# Altium schematic sheet lcd.SchDoc
size A
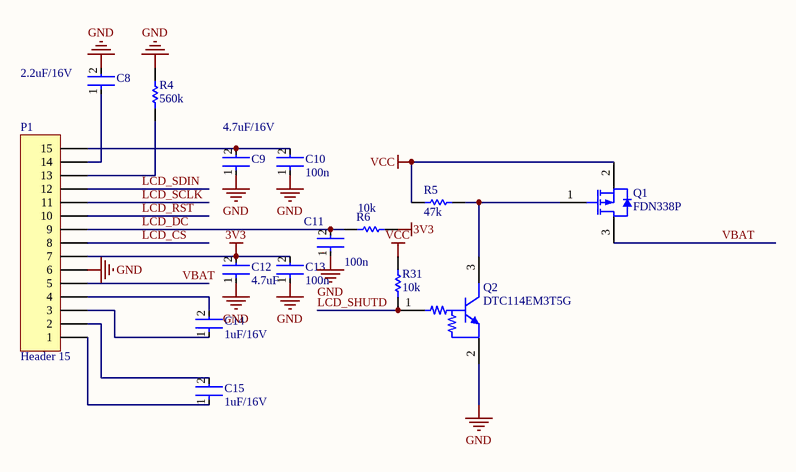
[diagram p0: lcd.SchDoc]

## Parts
C8  2.2uF/16V  [FP-GRM188-0_1-e0_2_0_55-IPC_A]
C9  4.7uF/16V  [FP-GRM188-0_1-e0_2_0_55-IPC_A]
C10  100n  [FP-GRM155-0_05-IPC_A]
C11  100n  [FP-GRM155-0_05-IPC_A]
C12  4.7uF  [FP-GRM188-0_1-e0_2_0_55-IPC_A]
C13  100n  [FP-GRM155-0_05-IPC_A]
C14  1uF/16V  [FP-GRM188-0_1-e0_2_0_55-IPC_A]
C15  1uF/16V  [FP-GRM188-0_1-e0_2_0_55-IPC_A]
P1  Header 15  [FLEX_CONN]
Q1  FDN338P  [FAIR-SSOT3L-3_V]
Q2  DTC114EM3T5G  [ONSC-SOT-723-3-631AA-01_V]
R4  560k  [RESC1005X40X25NL05T10]
R5  47k  [RESC1005X40X25NL05T10]
R6  10k  [RESC1005X40X25NL05T10]
R31  10k  [RESC1005X40X25NL05T10]

## Nets
3V3: C12.2 C13.2 P1.7 R6.1
GND: C8.2 C9.1 C10.1 C11.1 C12.1 C13.1 P1.6 Q2.2(E) R4.2
VCC: Q1.2(SOURCE) R5.1 R31.2
LCD_CS: P1.8
LCD_DC: C11.2 P1.9 R6.2
LCD_RST: P1.10
LCD_SCLK: P1.11
LCD_SDIN: P1.12
LCD_SHUTD: Q2.1(B) R31.1
VBAT: P1.5 Q1.3(DRAIN)
NetC8_1: C8.1 P1.14
NetC9_2: C9.2 C10.2 P1.15
NetC14_1: C14.1 P1.3
NetC14_2: C14.2 P1.4
NetC15_1: C15.1 P1.1
NetC15_2: C15.2 P1.2
NetP1_13: P1.13 R4.1
NetQ1_1: Q1.1(GATE) Q2.3(C) R5.2

## Library data of the parts
C8 C9 C12 C14 C15 = CMP-2006-02792-2: Chip Multilayer Ceramic Capacitors for General Purpose, 0603, 10uF, X5R, 15%, 20%, 6.3V; Packaging: Tape and Reel; Voltage Rating (DC): 6.3V; Width: 0.031inch; Termination: SMD/SMT; Dielectric: X5R; Package Quantity: 4000; Voltage Rating: 6.3V; Capacitance: 10uF; Case/Package: 0603; Min Operating Temperature: -55°C; Voltage: 6.3V; Length: 1.6mm; Thickness: 0.035inch; Lead Free: Lead Free; Depth: 0.8mm; Case Code (Imperial): 0603; Max Operating Temperature: 85°C; Material: Ceramic; Height: 0.8mm; Tolerance: 20%; Mount: Surface Mount; REACH SVHC: No SVHC; Radiation Hardening: No; Case Code (Metric): 1608
C10 C11 C13 = CMP-2008-04369-2: Chip Multilayer Ceramic Capacitors for General Purpose, 0402, 470pF, C0G, 30ppm/°C, 5%, 50V; Insulation Resistance: 10GR; Depth: 0.5mm; Voltage Rating: 50V; Packaging: Tape and Reel; Material: Ceramic; Lead Free: Lead Free; Max Operating Temperature: 125°C; Length: 1mm; Min Operating Temperature: -55°C; Height: 0.5mm; Width: 0.5mm; Thickness: 0.022inch; Voltage: 50V; Termination: SMD/SMT; Dielectric Material: Ceramic; REACH SVHC: No SVHC; Voltage Rating (DC): 50V; Package Quantity: 1; Dielectric: C0G; Radiation Hardening: No; Mount: Surface Mount; Case/Package: 0402; Number of Pins: 2; Tolerance: 5%; Temperature Coefficient: 30ppm/°C; Case Code (Metric): 1005; Capacitance: 470pF; Case Code (Imperial): 0402
P1 = Header 15: Header, 15-Pin; LatestRevisionDate: 17-Jul-2002; LatestRevisionNote: Re-released for DXP Platform.; Publisher: Altium Limited
Q1 = CMP-2000-06251-1: P-Channel Specified Power Trench(R) MOSFET, 2.5 V, -20 V, -1.6 A, -55 to 150 degC, 3-Pin SOT23, RoHS, Tape and Reel; Manufacturer: Fairchild Semiconductor; Current - Continuous Drain (Id) @ 25°C: 1.6A(Ta); Product Training Modules: HighVoltageSwitchesforPowerProcessingSMPSPowerSwitch; Gate Charge (Qg) @ Vgs: 6.2nC@4.5V; Package Version: Rev. 3, 05/2015; PCN Design/Specification: MoldCompound08/April/2008; Vgs(th) (Max) @ Id: 1.5V@250µA; FET Type: MOSFETP-Channel,MetalOxide; FET Feature: Standard; PCN Packaging: BinaryYearCodeMarking15/Jan/2014; Other Names: FDN338PTR; Online Catalog: P-ChannelLogicLevelGateFETs; Input Capacitance (Ciss) @ Vds: 451pF@10V; Rds On (Max) @ Id, Vgs: 115mOhm@1.6A,4.5V; Drain to Source Voltage (Vdss): 20V; Power - Max: 460mW; Datasheet Version: Rev. F1(W), 11/2013; Manufacturer URL: https://www.fairchildsemi.com/; Package Description: 3-Pin Small Outline Transistor, Body 2.92 x 1.4 mm, Pitch 0.95 mm; Datasheet URL: https://datasheet.ciiva.com/22655/1802191-22655335.pdf; Family: FETs-Single; Package URL: https://www.fairchildsemi.com/package-drawings/MA/MA03B.pdf; Package Reference: SSOT3L; Supplier Device Package: 3-SSOT; Standard Package: 3,000; Package / Case: TO-236-3,SC-59,SOT-23-3; Mounting Technology: SurfaceMount; Series: PowerTrench®; Mounting Type: SurfaceMount; Packaging: Tape&Reel(TR); Category: DiscreteSemiconductorProducts
Q2 = CMP-0630-00443-1: Digital Transistor (BRT), R1=10 kOhm, R2=10 kOhm, NPN Transistor, 3-Pin SOT-723, Pb-Free, Tape and Reel; Manufacturer: On Semiconductor; V(BR)CEO Min (V): 50; R1/R2 Typ: 1; IC Continuous (A): 0.1; hFE Min: 35; ComponentLink3Description: Package Specification; Packing: Tape and Reel; ComponentLink1Description: Manufacturer URL; DatasheetVersion: Rev. 5; PackageDescription: 3-Pin Small Outline Transistor, Body 1.2 x 0.8 mm, Pitch 0.4 mm; RoHS: TRUE; Mounting Technology: Surface Mount; ComponentLink2URL: http://www.onsemi.cn/pub_link/Collateral/DTC114E-D.PDF; ComponentLink2Description: Datasheet; ComponentLink1URL: http://www.onsemi.com/; Polarity: NPN; PackageVersion: Rev. D, 08/2009; PartNumber: DTC114EM3T5G; PackageReference: SOT-723-3-631AA-01; ComponentLink3URL: http://www.onsemi.com/pub_link/Collateral/631AA.PDF
R4-R6 R31 = CMP-1011-00001-2: Manufacturer: Yageo / Phycomp; Part Number: RC0402JR-070RL